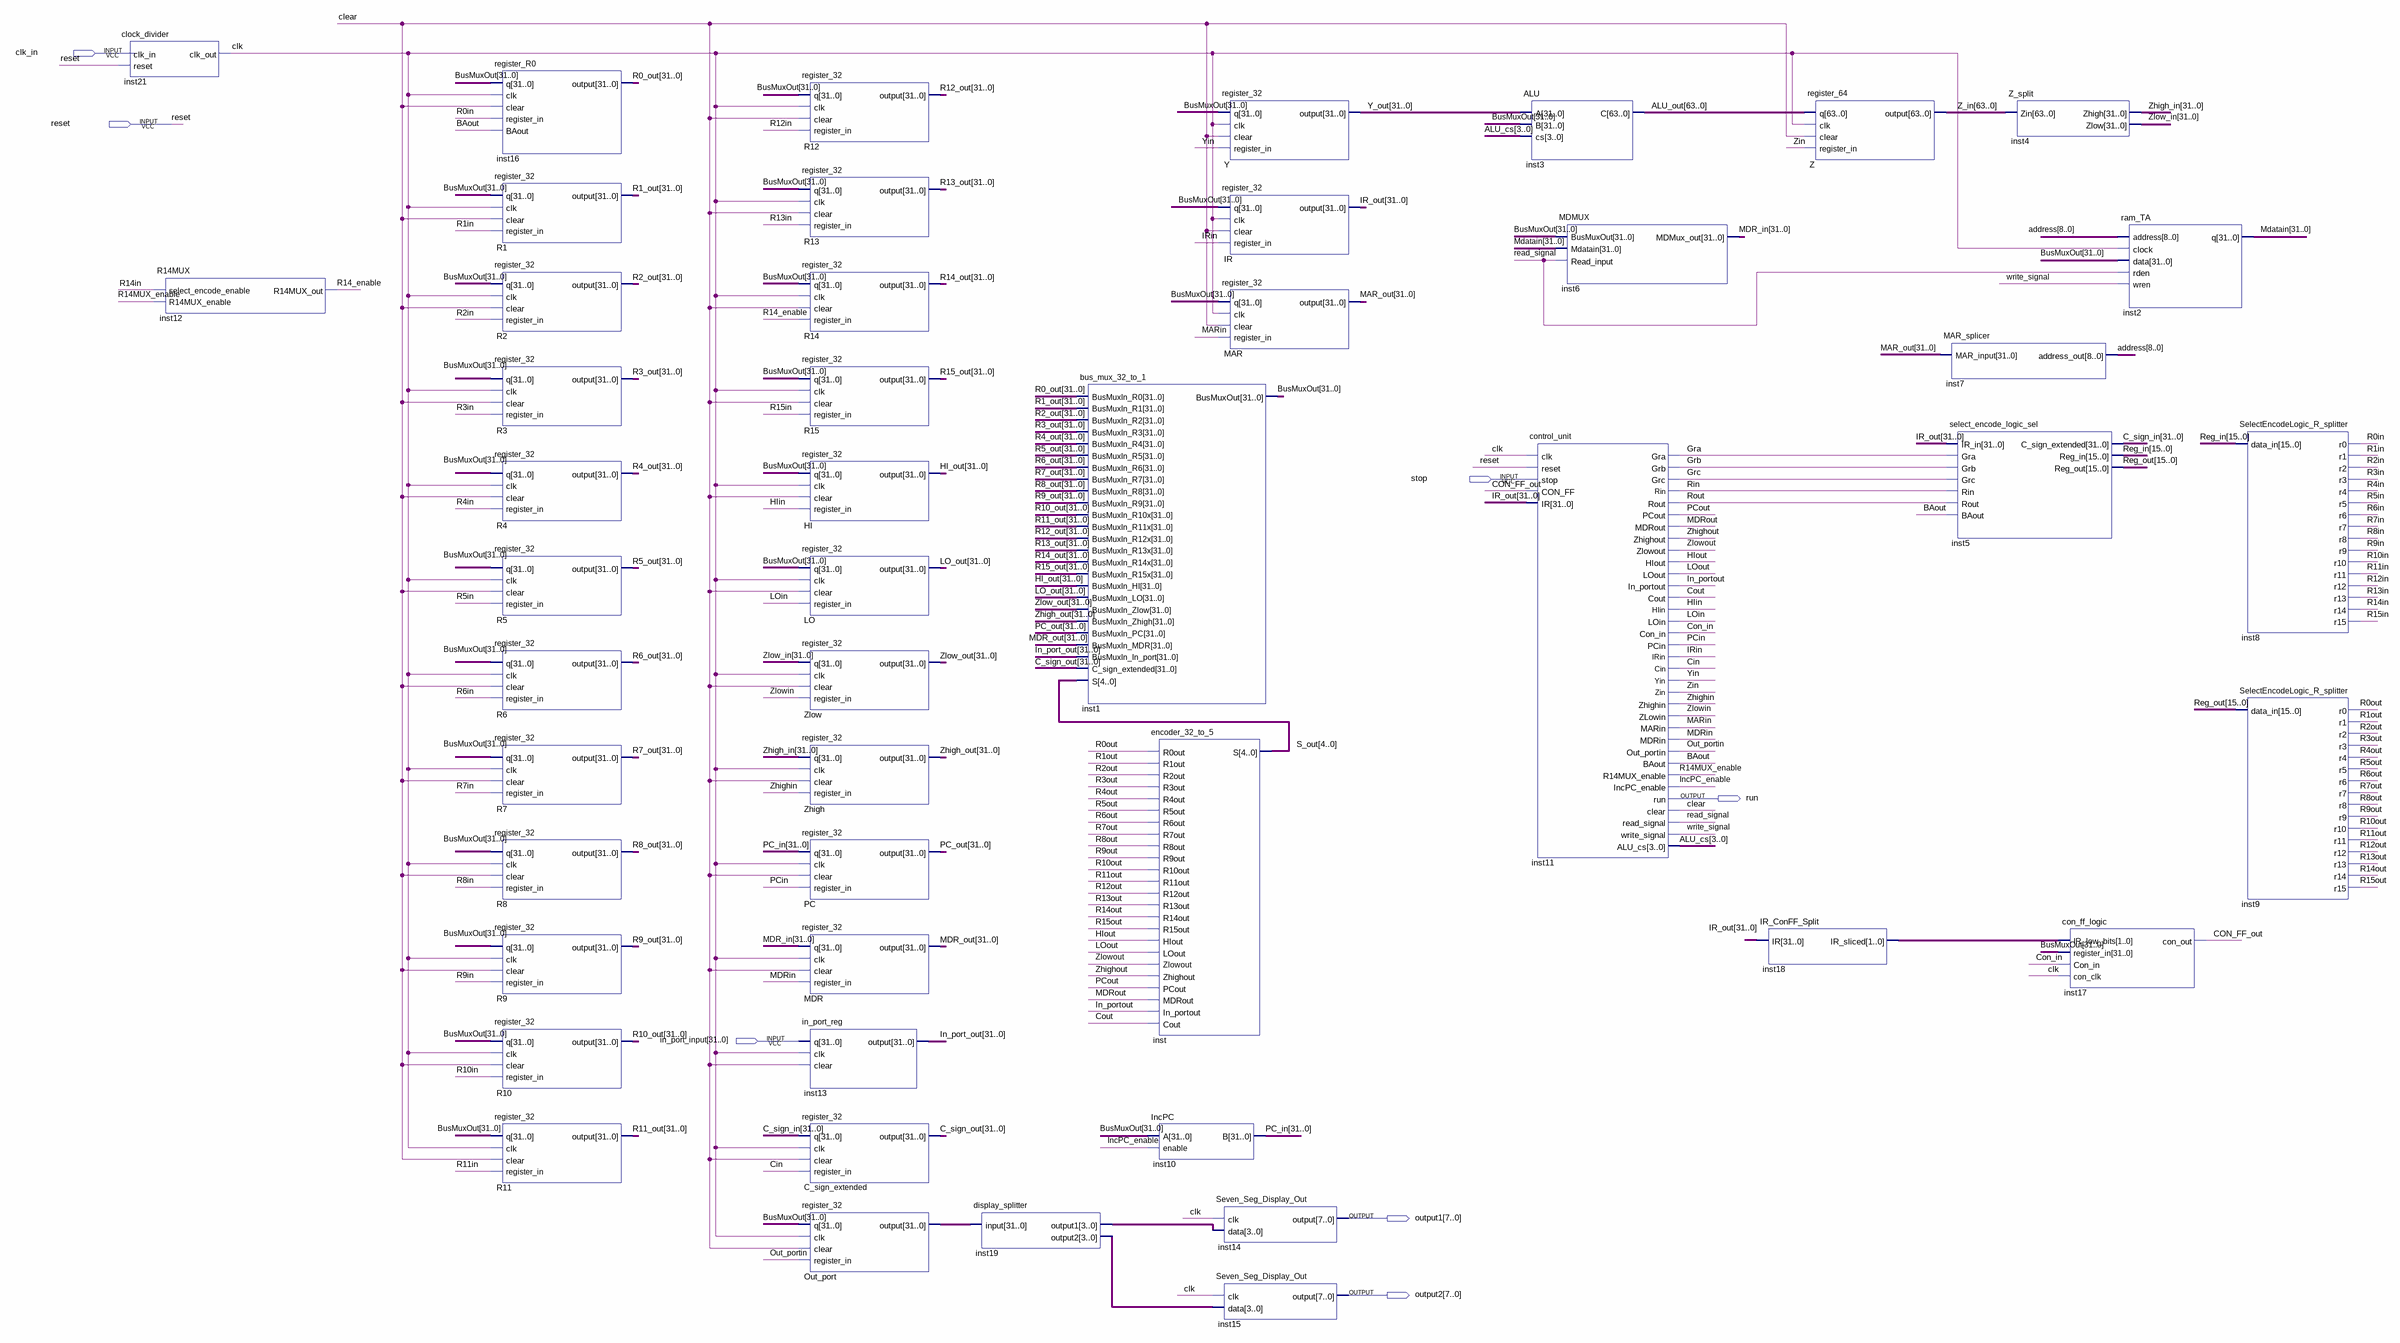
[diagram p0: schematic sheet]
// Quartus schematic phase4_original.bdf as structural Verilog: 48 symbols, 7 pins
module phase4_original (
  input  clk_in,
  input  reset,
  input  stop,
  input  [31:0] in_port_input,
  output run,
  output [7:0] output1,
  output [7:0] output2
);

  wire BAout, Cin, clear, clk, CON_FF_out, Con_in, Cout, Gra, Grb, Grc, HIin, HIout, In_portout,
       IncPC_enable, IRin, LOin, LOout, MARin, MDRin, MDRout, Out_portin, PCin, PCout, R0in, R0out, R1in,
       R1out, R2in, R2out, R3in, R3out, R4in, R4out, R5in, R5out, R6in, R6out, R7in, R7out, R8in, R8out,
       R9in, R9out, R10in, R10out, R11in, R11out, R12in, R12out, R13in, R13out, R14_enable, R14in,
       R14MUX_enable, R14out, R15in, R15out, read_signal, Rin, Rout, write_signal, Yin, Zhighin, Zhighout,
       Zin, Zlowin, Zlowout;
  wire [1:0] inst18_ir_sliced;
  wire [3:0] ALU_cs, inst19_output1, inst19_output2;
  wire [4:0] S_out;
  wire [8:0] address;
  wire [15:0] Reg_in, Reg_out;
  wire [31:0] BusMuxOut, C_sign_in, C_sign_out, HI_out, In_port_out, IR_out, LO_out, MAR_out, Mdatain,
       MDR_in, MDR_out, Out_port_output, PC_in, PC_out, R0_out, R1_out, R2_out, R3_out, R4_out, R5_out,
       R6_out, R7_out, R8_out, R9_out, R10_out, R11_out, R12_out, R13_out, R14_out, R15_out, Y_out, Zhigh_in,
       Zhigh_out, Zlow_in, Zlow_out;
  wire [63:0] ALU_out, Z_in;

  clock_divider inst21 (.clk_in(clk_in), .reset(reset), .clk_out(clk));
  R14MUX inst12 (.select_encode_enable(R14in), .R14MUX_enable(R14MUX_enable), .R14MUX_out(R14_enable));
  register_R0 inst16 (.q(BusMuxOut), .clk(clk), .clear(clear), .register_in(R0in), .BAout(BAout), .\output (R0_out));
  register_32 R1 (.q(BusMuxOut), .clk(clk), .clear(clear), .register_in(R1in), .\output (R1_out));
  register_32 R2 (.q(BusMuxOut), .clk(clk), .clear(clear), .register_in(R2in), .\output (R2_out));
  register_32 R3 (.q(BusMuxOut), .clk(clk), .clear(clear), .register_in(R3in), .\output (R3_out));
  register_32 R4 (.q(BusMuxOut), .clk(clk), .clear(clear), .register_in(R4in), .\output (R4_out));
  register_32 R5 (.q(BusMuxOut), .clk(clk), .clear(clear), .register_in(R5in), .\output (R5_out));
  register_32 R6 (.q(BusMuxOut), .clk(clk), .clear(clear), .register_in(R6in), .\output (R6_out));
  register_32 R7 (.q(BusMuxOut), .clk(clk), .clear(clear), .register_in(R7in), .\output (R7_out));
  register_32 R8 (.q(BusMuxOut), .clk(clk), .clear(clear), .register_in(R8in), .\output (R8_out));
  register_32 R9 (.q(BusMuxOut), .clk(clk), .clear(clear), .register_in(R9in), .\output (R9_out));
  register_32 R10 (.q(BusMuxOut), .clk(clk), .clear(clear), .register_in(R10in), .\output (R10_out));
  register_32 R11 (.q(BusMuxOut), .clk(clk), .clear(clear), .register_in(R11in), .\output (R11_out));
  register_32 R12 (.q(BusMuxOut), .clk(clk), .clear(clear), .register_in(R12in), .\output (R12_out));
  register_32 R13 (.q(BusMuxOut), .clk(clk), .clear(clear), .register_in(R13in), .\output (R13_out));
  register_32 R14 (.q(BusMuxOut), .clk(clk), .clear(clear), .register_in(R14_enable), .\output (R14_out));
  register_32 R15 (.q(BusMuxOut), .clk(clk), .clear(clear), .register_in(R15in), .\output (R15_out));
  register_32 HI (.q(BusMuxOut), .clk(clk), .clear(clear), .register_in(HIin), .\output (HI_out));
  register_32 LO (.q(BusMuxOut), .clk(clk), .clear(clear), .register_in(LOin), .\output (LO_out));
  register_32 Zlow (.q(Zlow_in), .clk(clk), .clear(clear), .register_in(Zlowin), .\output (Zlow_out));
  register_32 Zhigh (.q(Zhigh_in), .clk(clk), .clear(clear), .register_in(Zhighin), .\output (Zhigh_out));
  register_32 PC (.q(PC_in), .clk(clk), .clear(clear), .register_in(PCin), .\output (PC_out));
  register_32 MDR (.q(MDR_in), .clk(clk), .clear(clear), .register_in(MDRin), .\output (MDR_out));
  in_port_reg inst13 (.q(in_port_input), .clk(clk), .clear(clear), .\output (In_port_out));
  register_32 C_sign_extended (.clear(clear), .clk(clk), .q(C_sign_in), .register_in(Cin), .\output (C_sign_out));
  register_32 Out_port (.q(BusMuxOut), .clk(clk), .clear(clear), .register_in(Out_portin), .\output (Out_port_output));
  display_splitter inst19 (.\input (Out_port_output), .output1(inst19_output1), .output2(inst19_output2));
  bus_mux_32_to_1 inst1 (
    .BusMuxIn_R0(R0_out), .BusMuxIn_R1(R1_out), .BusMuxIn_R2(R2_out), .BusMuxIn_R3(R3_out),
    .BusMuxIn_R4(R4_out), .BusMuxIn_R5(R5_out), .BusMuxIn_R6(R6_out), .BusMuxIn_R7(R7_out),
    .BusMuxIn_R8(R8_out), .BusMuxIn_R9(R9_out), .BusMuxIn_R10x(R10_out), .BusMuxIn_R11x(R11_out),
    .BusMuxIn_R12x(R12_out), .BusMuxIn_R13x(R13_out), .BusMuxIn_R14x(R14_out), .BusMuxIn_R15x(R15_out),
    .BusMuxIn_HI(HI_out), .BusMuxIn_LO(LO_out), .BusMuxIn_Zlow(Zlow_out), .BusMuxIn_Zhigh(Zhigh_out),
    .BusMuxIn_PC(PC_out), .BusMuxIn_MDR(MDR_out), .BusMuxIn_In_port(In_port_out),
    .C_sign_extended(C_sign_out), .S(S_out), .BusMuxOut(BusMuxOut));
  encoder_32_to_5 inst (
    .R0out(R0out), .R1out(R1out), .R2out(R2out), .R3out(R3out), .R4out(R4out), .R5out(R5out), .R6out(R6out),
    .R7out(R7out), .R8out(R8out), .R9out(R9out), .R10out(R10out), .R11out(R11out), .R12out(R12out),
    .R13out(R13out), .R14out(R14out), .R15out(R15out), .HIout(HIout), .LOout(LOout), .Zlowout(Zlowout),
    .Zhighout(Zhighout), .PCout(PCout), .MDRout(MDRout), .In_portout(In_portout), .Cout(Cout), .S(S_out));
  IncPC inst10 (.A(BusMuxOut), .enable(IncPC_enable), .B(PC_in));
  register_32 Y (.q(BusMuxOut), .clk(clk), .clear(clear), .register_in(Yin), .\output (Y_out));
  register_32 IR (.clear(clear), .clk(clk), .q(BusMuxOut), .register_in(IRin), .\output (IR_out));
  register_32 MAR (.clear(clear), .clk(clk), .q(BusMuxOut), .register_in(MARin), .\output (MAR_out));
  Seven_Seg_Display_Out inst14 (.clk(clk), .data(inst19_output1), .\output (output1));
  Seven_Seg_Display_Out inst15 (.clk(clk), .data(inst19_output2), .\output (output2));
  ALU inst3 (.A(Y_out), .B(BusMuxOut), .cs(ALU_cs), .C(ALU_out));
  MDMUX inst6 (.BusMuxOut(BusMuxOut), .Mdatain(Mdatain), .Read_input(read_signal), .MDMux_out(MDR_in));
  control_unit inst11 (
    .clk(clk), .reset(reset), .stop(stop), .CON_FF(CON_FF_out), .IR(IR_out), .Gra(Gra), .Grb(Grb), .Grc(Grc),
    .Rin(Rin), .Rout(Rout), .PCout(PCout), .MDRout(MDRout), .Zhighout(Zhighout), .Zlowout(Zlowout),
    .HIout(HIout), .LOout(LOout), .In_portout(In_portout), .Cout(Cout), .HIin(HIin), .LOin(LOin),
    .Con_in(Con_in), .PCin(PCin), .IRin(IRin), .Cin(Cin), .Yin(Yin), .Zin(Zin), .Zhighin(Zhighin),
    .ZLowin(Zlowin), .MARin(MARin), .MDRin(MDRin), .Out_portin(Out_portin), .BAout(BAout),
    .R14MUX_enable(R14MUX_enable), .IncPC_enable(IncPC_enable), .run(run), .clear(clear),
    .read_signal(read_signal), .write_signal(write_signal), .ALU_cs(ALU_cs));
  IR_ConFF_Split inst18 (.IR(IR_out), .IR_sliced(inst18_ir_sliced));
  register_64 Z (.q(ALU_out), .clk(clk), .clear(clear), .register_in(Zin), .\output (Z_in));
  MAR_splicer inst7 (.MAR_input(MAR_out), .address_out(address));
  select_encode_logic_sel inst5 (
    .IR_in(IR_out), .Gra(Gra), .Grb(Grb), .Grc(Grc), .Rin(Rin), .Rout(Rout), .BAout(BAout),
    .C_sign_extended(C_sign_in), .Reg_in(Reg_in), .Reg_out(Reg_out));
  Z_split inst4 (.Zin(Z_in), .Zhigh(Zhigh_in), .Zlow(Zlow_in));
  con_ff_logic inst17 (
    .IR_low_bits(inst18_ir_sliced), .register_in(BusMuxOut), .Con_in(Con_in), .con_clk(clk),
    .con_out(CON_FF_out));
  ram_TA inst2 (.address(address), .clock(clk), .data(BusMuxOut), .rden(read_signal), .wren(write_signal), .q(Mdatain));
  SelectEncodeLogic_R_splitter inst8 (
    .data_in(Reg_in), .r0(R0in), .r1(R1in), .r2(R2in), .r3(R3in), .r4(R4in), .r5(R5in), .r6(R6in), .r7(R7in),
    .r8(R8in), .r9(R9in), .r10(R10in), .r11(R11in), .r12(R12in), .r13(R13in), .r14(R14in), .r15(R15in));
  SelectEncodeLogic_R_splitter inst9 (
    .data_in(Reg_out), .r0(R0out), .r1(R1out), .r2(R2out), .r3(R3out), .r4(R4out), .r5(R5out), .r6(R6out),
    .r7(R7out), .r8(R8out), .r9(R9out), .r10(R10out), .r11(R11out), .r12(R12out), .r13(R13out), .r14(R14out),
    .r15(R15out));
endmodule
